# Altium project Mother Board.PrjPcb
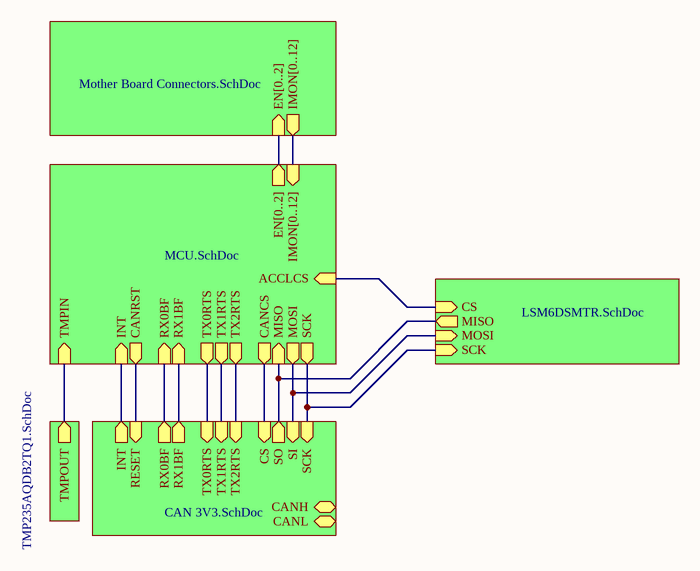
[diagram p0: Mother Board.SchDoc]
6 sheets, 34 parts. Net scope: hierarchical (ports join the sheet entries above them; power ports are global).
Board file: Mother Board.PcbDoc
Sheets:
  Mother Board.SchDoc
    Designator = Mother Board Connectors.SchDoc
    Designator = CAN 3V3.SchDoc
    Designator = TMP235AQDB2TQ1.SchDoc
    Designator = MCU.SchDoc
    Designator = LSM6DSMTR.SchDoc

## Sheet Mother Board.SchDoc
size A

### Sub-sheets
Designator = Mother Board Connectors.SchDoc: EN[0..2] (in), IMON[0..12] (out)
Designator = CAN 3V3.SchDoc: SI (in), SO (out), CANH (bidir), TX1RTS (in), RX0BF (out), INT (out), TX2RTS (in), CS (in), SCK (in), RESET (in), TX0RTS (in), CANL (bidir), RX1BF (out)
Designator = TMP235AQDB2TQ1.SchDoc: TMPOUT (out)
Designator = MCU.SchDoc: EN[0..2] (out), IMON[0..12] (in), MISO (in), INT (in), RX0BF (in), RX1BF (in), MOSI (out), TX2RTS (out), TX1RTS (out), TX0RTS (out), TMPIN (in), CANCS (out), SCK (out), CANRST (out), ACCLCS (in)
Designator = LSM6DSMTR.SchDoc: CS (in), MOSI (in), MISO (out), SCK (in)

### Nets
NetC1_1: sheet Designator/TMPOUT, sheet Designator/TMPIN
NetU5_4: sheet Designator/TX0RTS, sheet Designator/TX0RTS
NetU5_5: sheet Designator/TX1RTS, sheet Designator/TX1RTS
NetU5_6: sheet Designator/TX2RTS, sheet Designator/TX2RTS
NetU5_10: sheet Designator/RX1BF, sheet Designator/RX1BF
NetU5_11: sheet Designator/RX0BF, sheet Designator/RX0BF
NetU5_12: sheet Designator/INT, sheet Designator/INT
NetU5_13: sheet Designator/SCK, sheet Designator/SCK, sheet Designator/SCK
NetU5_14: sheet Designator/SI, sheet Designator/MOSI, sheet Designator/MOSI
NetU5_15: sheet Designator/SO, sheet Designator/MISO, sheet Designator/MISO
NetU5_16: sheet Designator/CS, sheet Designator/CANCS
NetU5_17: sheet Designator/RESET, sheet Designator/CANRST
NetU7_39: sheet Designator/ACCLCS, sheet Designator/CS

## Sheet Mother Board Connectors.SchDoc
size B
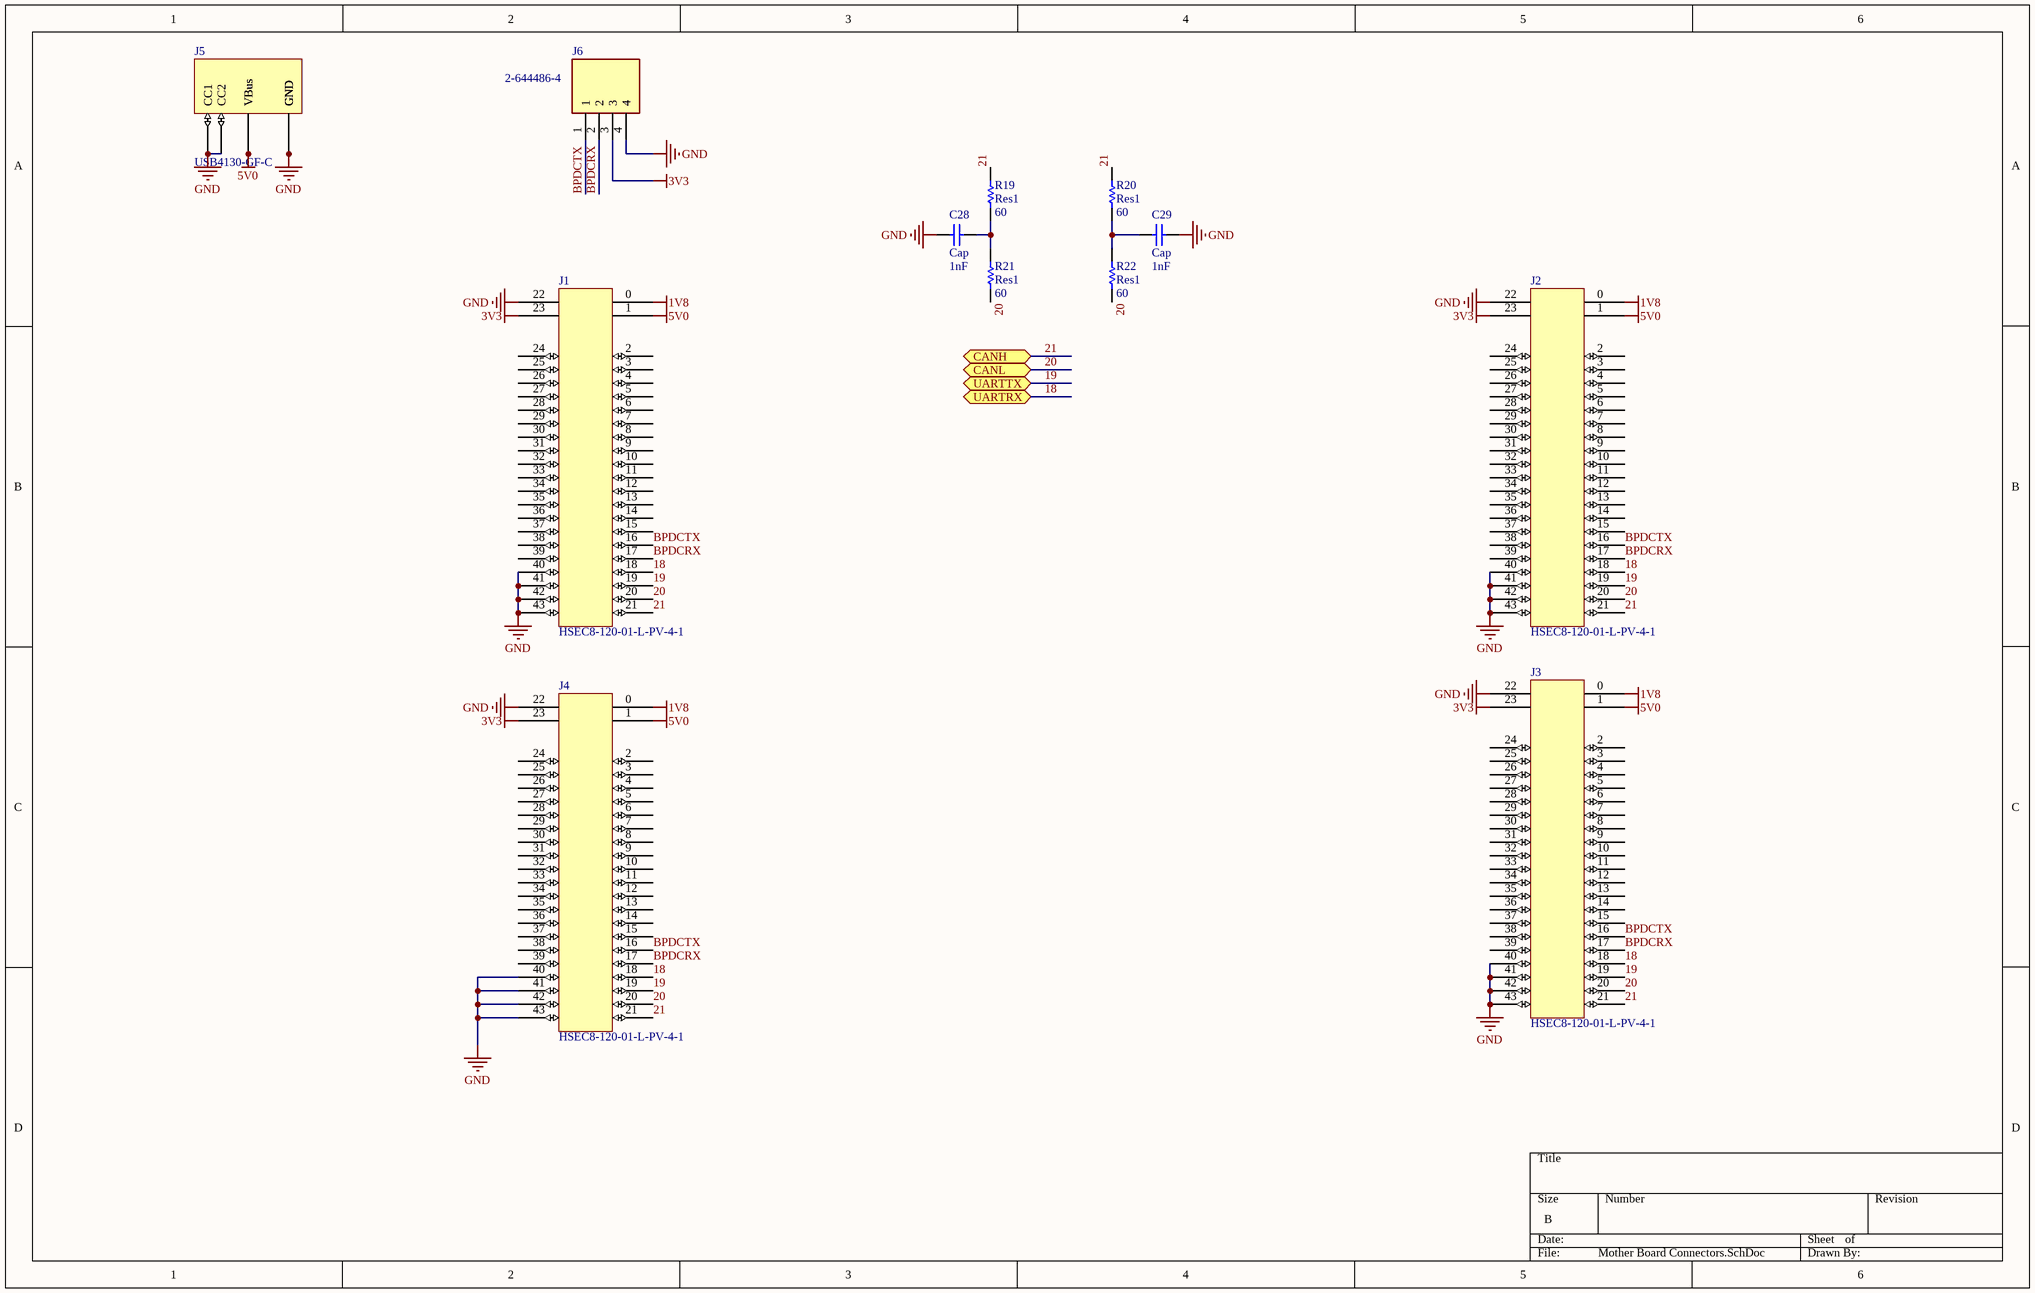
[diagram p1: Mother Board Connectors.SchDoc]

### Parts
C28  Cap  value 1nF  [1608[0603]]
C29  Cap  value 1nF  [1608[0603]]
J1  HSEC8-120-01-L-PV-4-1  [HSEC8-120-01-L-PV-4-1]
J2  HSEC8-120-01-L-PV-4-1  [HSEC8-120-01-L-PV-4-1]
J3  HSEC8-120-01-L-PV-4-1  [HSEC8-120-01-L-PV-4-1]
J4  HSEC8-120-01-L-PV-4-1  [HSEC8-120-01-L-PV-4-1]
J5  USB4130-GF-C  [USB4130-GF-C]
J6  2-644486-4  [26444864]
R19  Res1  value 60  [0402-A]
R20  Res1  value 60  [0402-A]
R21  Res1  value 60  [0402-A]
R22  Res1  value 60  [0402-A]

### Ports
CANH (bidir), CANL (bidir), UARTRX (bidir), UARTTX (bidir)

### Nets
1V8: J1.0 J2.0 J3.0 J4.0
3V3: J1.23 J2.23 J3.23 J4.23 J6.3
5V0: J1.1 J2.1 J3.1 J4.1 J5.2(VBus) J5.5(VBus)
GND: C28.2 C29.1 J1.22 J1.40 J1.41 J1.42 J1.43 J2.22 J2.40 J2.41 J2.42 J2.43 J3.22 J3.40 J3.41 J3.42 J3.43 J4.22 J4.40 J4.41 J4.42 J4.43 J5.1(GND) J5.3(CC1) J5.4(CC2) J5.6(GND) J5.7(GND) J5.8(GND) J6.4
18: J1.18 J2.18 J3.18 J4.18 ; port UARTRX
19: J1.19 J2.19 J3.19 J4.19 ; port UARTTX
20: J1.20 J2.20 J3.20 J4.20 R21.1 R22.1 ; port CANL
21: J1.21 J2.21 J3.21 J4.21 R19.2 R20.2 ; port CANH
BPDCRX: J1.17 J2.17 J3.17 J4.17 J6.2
BPDCTX: J1.16 J2.16 J3.16 J4.16 J6.1
NetC28_1: C28.1 R19.1 R21.2
NetC29_2: C29.2 R20.1 R22.2

Not connected (* = marked no-connect by the designer): J1 2(0) 3(0) 4(0) 5(0) 6(0) 7(0) 8(0) 9(0) 10(0) 11(0) 12(0) 13(0) 14(0) 15(0) 24 25 26 27 28 29 30 31 32 33 34 35 36 37 38 39; J2 2(0) 3(0) 4(0) 5(0) 6(0) 7(0) 8(0) 9(0) 10(0) 11(0) 12(0) 13(0) 14(0) 15(0) 24 25 26 27 28 29 30 31 32 33 34 35 36 37 38 39; J3 2(0) 3(0) 4(0) 5(0) 6(0) 7(0) 8(0) 9(0) 10(0) 11(0) 12(0) 13(0) 14(0) 15(0) 24 25 26 27 28 29 30 31 32 33 34 35 36 37 38 39; J4 2(0) 3(0) 4(0) 5(0) 6(0) 7(0) 8(0) 9(0) 10(0) 11(0) 12(0) 13(0) 14(0) 15(0) 24 25 26 27 28 29 30 31 32 33 34 35 36 37 38 39

### Library data of the parts
C28 C29 = Cap: Capacitor; Published: 8-Jun-2000; LatestRevisionDate: 17-Jul-2002; LatestRevisionNote: Re-released for DXP Platform.; PackageReference: RAD-0.3; Publisher: Altium Limited; PackageDescription: Radial Cap, Thru-Hole; 2 Leads; 0.3 in Pin Spacing
J6 = 2-644486-4: Connector; Manufacturer_Name: TE Connectivity; Datasheet Link: http://www.te.com/commerce/DocumentDelivery/DDEController?Action=showdoc&DocId=Customer+Drawing%7F644486%7FL%7Fpdf%7FEnglish%7FENG_CD_644486_L_baseFilename.pdf%7F2-644486-4.pdf; Height: 10.668mm; Manufacturer_Part_Number: 2-644486-4; Mouser Part Number: 571-2-644486-4; Mouser Price/Stock: https://www.mouser.co.uk/ProductDetail/TE-Connectivity-AMP/2-644486-4?qs=8XyASyDp%2FcDn2y5ith8QSA%3D%3D; Arrow Part Number: 2-644486-4; Arrow Price/Stock: https://www.arrow.com/en/products/2-644486-4/te-connectivity
R19-R22 = Res1: Resistor; Published: 8-Jun-2000; LatestRevisionDate: 17-Jul-2002; LatestRevisionNote: Re-released for DXP Platform.; PackageReference: AXIAL-0.3; Publisher: Altium Limited; PackageDescription: Axial Device, Thru-Hole; 2 Leads; 0.3 in Pin Spacing
J1-J4 = HSEC8-120-01-L-PV-4-1: Supplier 1: Mouser

## Sheet CAN 3V3.SchDoc
size A
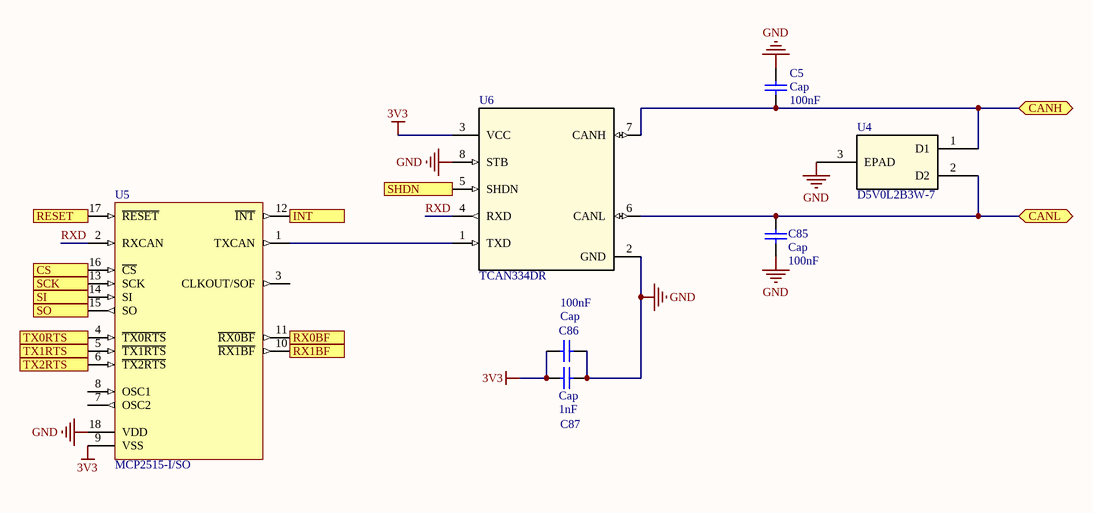
[diagram p2: CAN 3V3.SchDoc]

### Parts
C5  Cap  value 100nF  [1608[0603]]
C85  Cap  value 100nF  [1608[0603]]
C86  Cap  value 100nF  [1608[0603]]
C87  Cap  value 1nF  [1608[0603]]
U4  D5V0L2B3W-7  [SOT-323_DIO]
U5  MCP2515-I/SO  [SOIC-SO18_L]
U6  TCAN334DR  [D0008A_N]

### Ports
CANH (bidir), CANL (bidir), CS (in), INT (out), RESET (in), RX0BF (out), RX1BF (out), SCK (in), SHDN (in), SI (in), SO (out), TX0RTS (in), TX1RTS (in), TX2RTS (in)

### Nets
3V3: C86.1 C87.2 U5.9(VSS) U6.3(VCC)
GND: C5.1 C85.1 C86.2 C87.1 U4.3(EPAD) U5.18(VDD) U6.2(GND) U6.8(STB)
RXD: U5.2(RXCAN) U6.4(RXD)
NetC5_2: C5.2 U4.1(D1) U6.7(CANH) ; port CANH
NetC85_2: C85.2 U4.2(D2) U6.6(CANL) ; port CANL
NetU5_1: U5.1(TXCAN) U6.1(TXD)
NetU5_4: U5.4(~{TX0RTS}) ; port TX0RTS
NetU5_5: U5.5(~{TX1RTS}) ; port TX1RTS
NetU5_6: U5.6(~{TX2RTS}) ; port TX2RTS
NetU5_10: U5.10(~{RX1BF}) ; port RX1BF
NetU5_11: U5.11(~{RX0BF}) ; port RX0BF
NetU5_12: U5.12(~{INT}) ; port INT
NetU5_13: U5.13(SCK) ; port SCK
NetU5_14: U5.14(SI) ; port SI
NetU5_15: U5.15(SO) ; port SO
NetU5_16: U5.16(~{CS}) ; port CS
NetU5_17: U5.17(~{RESET}) ; port RESET
NetU6_5: U6.5(SHDN) ; port SHDN

Not connected (* = marked no-connect by the designer): U5 3(CLKOUT/SOF) 7(OSC2) 8(OSC1)

### Library data of the parts
C5 C85-C87 = Cap: Capacitor; Published: 8-Jun-2000; LatestRevisionDate: 17-Jul-2002; LatestRevisionNote: Re-released for DXP Platform.; PackageReference: RAD-0.3; Publisher: Altium Limited; PackageDescription: Radial Cap, Thru-Hole; 2 Leads; 0.3 in Pin Spacing
U4 = D5V0L2B3W-7: No Description Available; Vendor: Diodes Inc; Built_By: EMA_UL_Team; SourceLibrary: DIODESINC_2_2015-08-18; Manufacturer_Part_Number: D5V0L2B3W-7; Copyright: Copyright (C) 2018 Accelerated Designs. All rights reserved; RefDes: RefDes; Type: DEV
U5 = CMP-0186-00133-2: Stand-Alone CAN Controller With SPI Interface, 18-Pin SOIC, Industrial Temperature; ComponentLink2Description: Datasheet; RevisionNote: URLs added. DatasheetVersion updated.; PackageVersion: revBB, Aug-2009; ComponentLink1URL: http://www.microchip.com/; PackageReference: SOIC-SO18; PackageDescription: 18-Lead Plastic Small Outline (SO) - Wide 7.50mm Body [SOIC]; DatasheetVersion: revF, Oct-2010; ComponentLink2URL: http://ww1.microchip.com/downloads/en/DeviceDoc/21801f.pdf; ComponentLink3URL: http://www.microchip.com/stellent/groups/techpub_sg/documents/packagingspec/en012702.pdf; Code_JEDEC: MS-013; ComponentLink3Description: Package Specification; ComponentLink1Description: Manufacturer URL
U6 = TCAN334DR: No Description Available; Manufacturer: Texas Instruments; PartNumber: TCAN334DR; RefDes: RefDes; Type: DEV; Value: Value; Copyright: Copyright (C) 2018 Accelerated Designs. All rights reserved

## Sheet TMP235AQDB2TQ1.SchDoc
size A
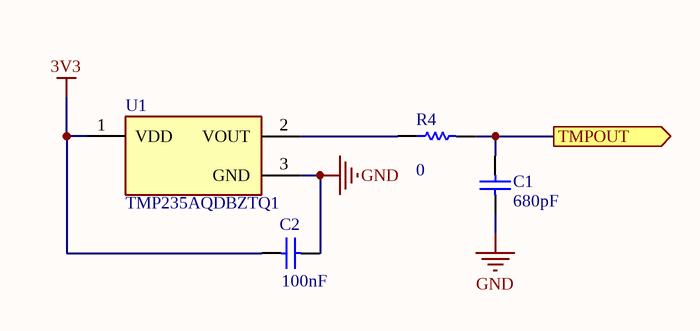
[diagram p3: TMP235AQDB2TQ1.SchDoc]

### Parts
C1  value 680pF  [1608[0603]]  (hidden comment: Cap)
C2  value 100nF  [1608[0603]]  (hidden comment: Cap)
R4  value 0  [0402-A]  (hidden comment: Res1)
U1  TMP235AQDBZTQ1  [FP-DBZ0003A-MFG]

### Ports
TMPOUT (out)

### Nets
3V3: C2.1 U1.1(VDD)
GND: C1.2 C2.2 U1.3(GND)
NetC1_1: C1.1 R4.2 ; port TMPOUT
NetR4_1: R4.1 U1.2(VOUT)

### Library data of the parts
C1 C2 = Cap: Capacitor; Published: 8-Jun-2000; LatestRevisionDate: 17-Jul-2002; LatestRevisionNote: Re-released for DXP Platform.; PackageReference: RAD-0.3; Publisher: Altium Limited; PackageDescription: Radial Cap, Thru-Hole; 2 Leads; 0.3 in Pin Spacing
R4 = Res1: Resistor; Published: 8-Jun-2000; LatestRevisionDate: 17-Jul-2002; LatestRevisionNote: Re-released for DXP Platform.; PackageReference: AXIAL-0.3; Publisher: Altium Limited; PackageDescription: Axial Device, Thru-Hole; 2 Leads; 0.3 in Pin Spacing
U1 = CMP-04948-000003-1: LOW-POWER HIGH-ACCURACY ANALOG O; Manufacturer: Texas Instruments; Manufacturer Part Number: TMP235A2DBZR; Output Current: 500uA; Operating Supply Current: 9uA; Max Supply Voltage: 5.5V; Max Junction Temp: +150°C; Accuracy: 0.5%; Min Supply Voltage: 2.3V; Standoff Height: 0.01mm; Sensor Output: Analog Voltage; Ambient Temperature Range Low: -40°C; Device Class L2: Temperature and Humidity Sensors; Digikey Description: LOW-POWER HIGH-ACCURACY ANALOG O; Lead Free: Yes; Category: IC; Device Class L3: unset; Temperature Range Low: -40°C; ComponentLink2Description: Datasheet; Package: DBZ0003A; Octopart: https://octopart.com/tmp235a2dbzr-texas+instruments-94966376; Device Class L1: Sensors; Temperature Range High: +150°C; Height: 1.12mm; Temperature: -40°C to +150°C; RoHS: TRUE; Ambient Temperature Range High: +150°C; Automotive: No; ComponentLink2URL: http://www.ti.com/lit/ds/symlink/tmp235.pdf; Mouser Description: ±2°C Analog output temperature sensor, with 10mV /°C gain 3-SOT-23 -40 to 150

## Sheet MCU.SchDoc
size A
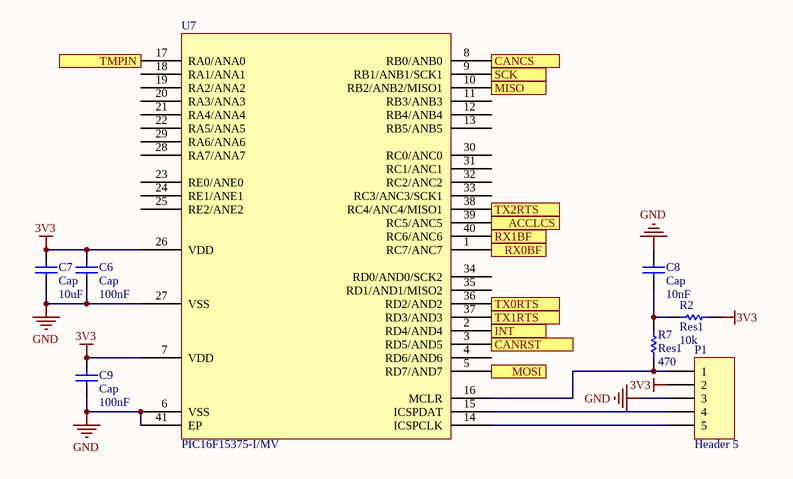
[diagram p4: MCU.SchDoc]

### Parts
C6  Cap  value 100nF  [1608[0603]]
C7  Cap  value 10uF  [6-0805_M]
C8  Cap  value 10nF  [1608[0603]]
C9  Cap  value 100nF  [1608[0603]]
P1  Header 5  [HDR1X5]
R2  Res1  value 10k  [0402-A]
R7  Res1  value 470  [0402-A]
U7  PIC16F15375-I/MV  [PIC16F15375-I/MV]

### Ports
ACCLCS (in), CANCS (out), CANRST (out), INT (in), MISO (in), MOSI (out), RX0BF (in), RX1BF (in), SCK (out), TMPIN (in), TX0RTS (out), TX1RTS (out), TX2RTS (out)

### Nets
3V3: C6.2 C7.2 C9.2 P1.2 R2.2 U7.7(VDD) U7.26(VDD)
GND: C6.1 C7.1 C8.1 C9.1 P1.3 U7.6(VSS) U7.27(VSS) U7.41(EP)
NetC1_1: U7.17(RA0/ANA0) ; port TMPIN
NetC8_2: C8.2 R2.1 R7.2
NetP1_1: P1.1 R7.1 U7.16(MCLR)
NetP1_4: P1.4 U7.15(ICSPDAT)
NetP1_5: P1.5 U7.14(ICSPCLK)
NetU5_4: U7.36(RD2/AND2) ; port TX0RTS
NetU5_5: U7.37(RD3/AND3) ; port TX1RTS
NetU5_6: U7.38(RC4/ANC4/MISO1) ; port TX2RTS
NetU5_10: U7.40(RC6/ANC6) ; port RX1BF
NetU5_11: U7.1(RC7/ANC7) ; port RX0BF
NetU5_12: U7.2(RD4/AND4) ; port INT
NetU5_13: U7.9(RB1/ANB1/SCK1) ; port SCK
NetU5_14: U7.5(RD7/AND7) ; port MOSI
NetU5_15: U7.10(RB2/ANB2/MISO1) ; port MISO
NetU5_16: U7.8(RB0/ANB0) ; port CANCS
NetU5_17: U7.3(RD5/AND5) ; port CANRST
NetU7_39: U7.39(RC5/ANC5) ; port ACCLCS

Not connected (* = marked no-connect by the designer): U7 4(RD6/AND6) 11(RB3/ANB3) 12(RB4/ANB4) 13(RB5/ANB5) 18(RA1/ANA1) 19(RA2/ANA2) 20(RA3/ANA3) 21(RA4/ANA4) 22(RA5/ANA5) 23(RE0/ANE0) 24(RE1/ANE1) 25(RE2/ANE2) 28(RA7/ANA7) 29(RA6/ANA6) 30(RC0/ANC0) 31(RC1/ANC1) 32(RC2/ANC2) 33(RC3/ANC3/SCK1) 34(RD0/AND0/SCK2) 35(RD1/AND1/MISO2)

### Library data of the parts
C6-C9 = Cap: Capacitor; Published: 8-Jun-2000; LatestRevisionDate: 17-Jul-2002; LatestRevisionNote: Re-released for DXP Platform.; PackageReference: RAD-0.3; Publisher: Altium Limited; PackageDescription: Radial Cap, Thru-Hole; 2 Leads; 0.3 in Pin Spacing
P1 = Header 5: Header, 5-Pin; LatestRevisionDate: 17-Jul-2002; LatestRevisionNote: Re-released for DXP Platform.; Publisher: Altium Limited
R2 R7 = Res1: Resistor; Published: 8-Jun-2000; LatestRevisionDate: 17-Jul-2002; LatestRevisionNote: Re-released for DXP Platform.; PackageReference: AXIAL-0.3; Publisher: Altium Limited; PackageDescription: Axial Device, Thru-Hole; 2 Leads; 0.3 in Pin Spacing

## Sheet LSM6DSMTR.SchDoc
size A
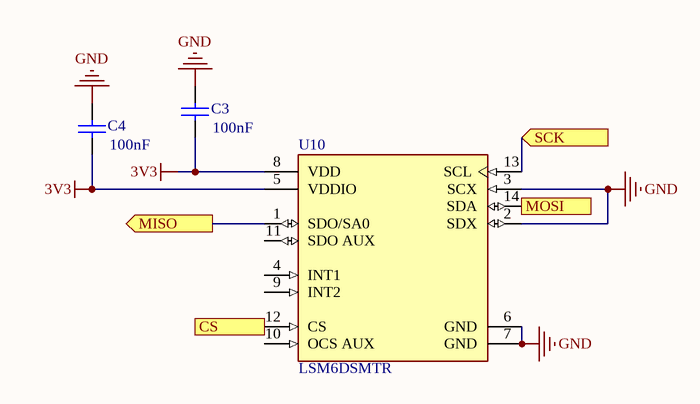
[diagram p5: LSM6DSMTR.SchDoc]

### Parts
C3  value 100nF  [1608[0603]]  (hidden comment: Cap)
C4  value 100nF  [1608[0603]]  (hidden comment: Cap)
U10  LSM6DSMTR  [FP-LGA-14L-DM00249496-MFG]

### Ports
CS (in), MISO (out), MOSI (in), SCK (in)

### Nets
3V3: C3.2 C4.2 U10.5(VDDIO) U10.8(VDD)
GND: C3.1 C4.1 U10.2(SDX) U10.3(SCX) U10.6(GND) U10.7(GND)
NetU5_13: U10.13(SCL) ; port SCK
NetU5_14: U10.14(SDA) ; port MOSI
NetU5_15: U10.1(SDO/SA0) ; port MISO
NetU7_39: U10.12(CS) ; port CS

Not connected (* = marked no-connect by the designer): U10 4(INT1) 9(INT2) 10(OCS_AUX) 11(SDO_AUX)

### Library data of the parts
C3 C4 = Cap: Capacitor; Published: 8-Jun-2000; LatestRevisionDate: 17-Jul-2002; LatestRevisionNote: Re-released for DXP Platform.; PackageReference: RAD-0.3; Publisher: Altium Limited; PackageDescription: Radial Cap, Thru-Hole; 2 Leads; 0.3 in Pin Spacing
U10 = CMP-12177-000008-1: IMU ACCEL/GYRO I2C/SPI 14LGA; Manufacturer: STMicroelectronics; Operating Supply Current: 0.29-0.65mA; Gyro Range: 125/250/500/1000/2000°/s; Sensor Output: I2C,SPI; Accel Range: 2/4/8/16g; Min Supply Voltage: 1.62V; Resolution: 16bits; Sensor Type: Temperature,Accelerometer,Gyroscope; Max Supply Voltage: 3.6V; Manufacturer Part Number: LSM6DSMTR; Octopart: https://octopart.com/lsm6dsmtr-stmicroelectronics-66358194; Height: 0.86mm; Category: IC; Lead Free: Yes; Temperature: -40°C to +85°C; Temperature Range Low: -40°C; ComponentLink2Description: Datasheet; ComponentLink2URL: https://www.st.com/resource/en/datasheet/lsm6dsm.pdf; Digikey Description: IMU ACCEL/GYRO I2C/SPI 14LGA; Footprint Url: https://www.st.com/content/ccc/resource/technical/document/technical_note/73/17/9c/16/dd/96/4a/01/CD00134799.pdf/files/CD00134799.pdf/jcr:content/translations/en.CD00134799.pdf; Device Class L1: Sensors; Device Class L2: Motion Sensors; Temperature Range High: +85°C; Mouser Description: LSM6DSM Series 3.6 V I2C/SPI 3D Accelerometer and 3D Gyroscope - LGA-14; Device Class L3: Inertial Measurement Units (IMUs); Automotive: No; Package: LGA-14L-DM00249496; RoHS: TRUE

## Nets that join several sheets
3V3: Mother Board Connectors (5 pins), CAN 3V3 (C86.1 C87.2 U5.9 U6.3), TMP235AQDB2TQ1 (C2.1 U1.1), MCU (7 pins), LSM6DSMTR (C3.2 C4.2 U10.5 U10.8)
GND: Mother Board Connectors (29 pins), CAN 3V3 (8 pins), TMP235AQDB2TQ1 (C1.2 C2.2 U1.3), MCU (8 pins), LSM6DSMTR (6 pins)
NetC1_1: TMP235AQDB2TQ1 (C1.1 R4.2), MCU (U7.17)
NetU5_4: CAN 3V3 (U5.4), MCU (U7.36)
NetU5_5: CAN 3V3 (U5.5), MCU (U7.37)
NetU5_6: CAN 3V3 (U5.6), MCU (U7.38)
NetU5_10: CAN 3V3 (U5.10), MCU (U7.40)
NetU5_11: CAN 3V3 (U5.11), MCU (U7.1)
NetU5_12: CAN 3V3 (U5.12), MCU (U7.2)
NetU5_13: CAN 3V3 (U5.13), MCU (U7.9), LSM6DSMTR (U10.13)
NetU5_14: CAN 3V3 (U5.14), MCU (U7.5), LSM6DSMTR (U10.14)
NetU5_15: CAN 3V3 (U5.15), MCU (U7.10), LSM6DSMTR (U10.1)
NetU5_16: CAN 3V3 (U5.16), MCU (U7.8)
NetU5_17: CAN 3V3 (U5.17), MCU (U7.3)
NetU7_39: MCU (U7.39), LSM6DSMTR (U10.12)